# Altium schematic sheet Photo.SchDoc
size A
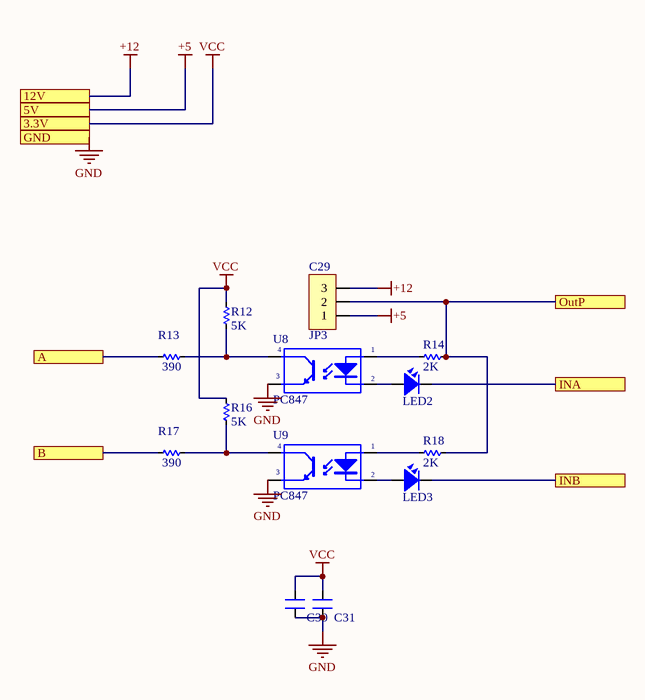
[diagram p0: Photo.SchDoc]

## Parts
C29  JP3  [JP3-C1T]
C30  100nF  [CN-SMD-0603_big]  (value not drawn)
C31  100nF  [CN-SMD-0603_big]  (value not drawn)
LED2  LED  [LED-0805-Green]  (value not drawn)
LED3  LED  [LED-0805-Green]  (value not drawn)
R12  5K  [RES-SMD-0603_BIG]
R13  390  [RES-SMD-0603_BIG]
R14  2K  [RES-SMD-0603_BIG]
R16  5K  [RES-SMD-0603_BIG]
R17  390  [RES-SMD-0603_BIG]
R18  2K  [RES-SMD-0603_BIG]
U8  PC847  [DIP4]
U9  PC847  [DIP4]

## Ports
3.3V, 5V, 12V, A, B, GND, INA, INB, OutP

## Nets
+5: C29.1 ; port 5V
+12: C29.3 ; port 12V
GND: C30.1 C31.1 U8.3(E) U9.3(E) ; port GND
VCC: C30.2 C31.2 R12.1 R16.1 ; port 3.3V
A: R13.1 ; port A
B: R17.1 ; port B
INA: LED2.2 ; port INA
INB: LED3.2 ; port INB
OutP: C29.2 R14.1 R18.1 ; port OutP
NetLED2_1: LED2.1 U8.2(K)
NetLED3_1: LED3.1 U9.2(K)
NetR12_2: R12.2 R13.2 U8.4(C)
NetR14_2: R14.2 U8.1(A)
NetR16_2: R16.2 R17.2 U9.4(C)
NetR18_2: R18.2 U9.1(A)

## Library data of the parts
C29 = JP3: WR-PHD 2.54 mm Angled Socket Header; Manufacturer: W¨¹rth Elektronik eiSos GmbH; partNo: 613003143121; ComponentLink1 Description: Manufacturer; ComponentLink2 Description: Datasheet; NoPins: 03; Created Date: 29 March 2013; ComponentLink1URL: http://www.we-online.com; ComponentLink2URL: http://katalog.we-online.de/em/datasheet/6130xx143121.pdf; Created by: Karrer Zheng
C30 C31 = CN: Value: 33pF
LED2 LED3 = LED SMD: Value: LED 3 - 5 ly 2 Colour
R12-R14 R16-R18 = R
U8 U9 = PC817: Single Opto; Value: PC817